# Altium schematic sheet LevelShiftDAC.SchDoc
size A4
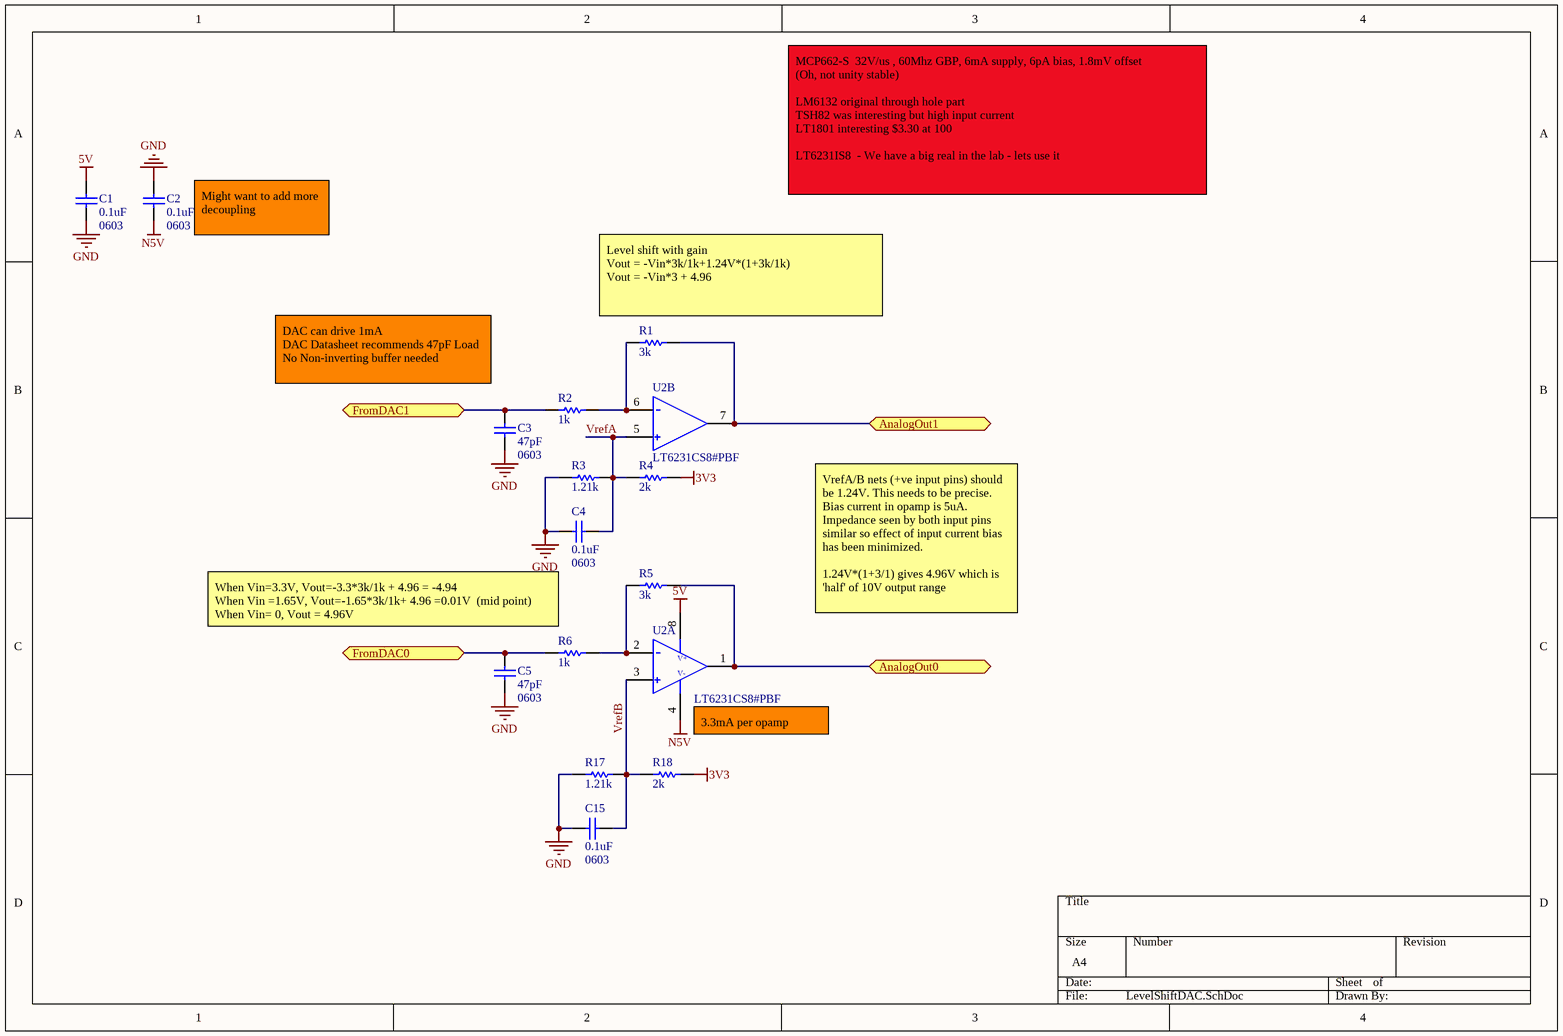
[diagram p0: LevelShiftDAC.SchDoc]

## Parts
C1  0.1uF  [0603]
C2  0.1uF  [0603]
C3  47pF  [0603]
C4  0.1uF  [0603]
C5  47pF  [0603]
C15  0.1uF  [0603]
R1  value 3k  [0603]  (hidden comment: Res0603)
R2  value 1k  [0603]  (hidden comment: Res0603)
R3  value 1.21k  [0603]  (hidden comment: Res0603)
R4  value 2k  [0603]  (hidden comment: Res0603)
R5  value 3k  [0603]  (hidden comment: Res0603)
R6  value 1k  [0603]  (hidden comment: Res0603)
R17  value 1.21k  [0603]  (hidden comment: Res0603)
R18  value 2k  [0603]  (hidden comment: Res0603)
U2  LT6231CS8#PBF  [SO8]  (parts A,B of 2)

## Ports
AnalogOut0, AnalogOut1, FromDAC0, FromDAC1

## Nets
3V3: R4.2 R18.2
5V: C1.2 U2.8(V+)
GND: C1.1 C2.2 C3.1 C4.1 C5.1 C15.1 R3.1 R17.1
N5V: C2.1 U2.4(V-)
AnalogOut0: R5.2 U2.1(Out) ; port AnalogOut0
AnalogOut1: R1.2 U2.7(Out) ; port AnalogOut1
FromDAC0: C5.2 R6.1 ; port FromDAC0
FromDAC1: C3.2 R2.1 ; port FromDAC1
VrefA: C4.2 R3.2 R4.1 U2.5(IN+)
VrefB: C15.2 R17.2 R18.1 U2.3(IN+)
NetR1_1: R1.1 R2.2 U2.6(IN-)
NetR5_1: R5.1 R6.2 U2.2(IN-)

## Notes on the sheet
- (near C2) Might want to add more decoupling
- MCP662-S  32V/us , 60Mhz GBP, 6mA supply, 6pA bias, 1.8mV offset
  (Oh, not unity stable)
  LM6132 original through hole part
  TSH82 was interesting but high input current
  LT1801 interesting $3.30 at 100
  LT6231IS8  - We have a big real in the lab - lets use it
- (near R1) Level shift with gain
  Vout = -Vin*3k/1k+1.24V*(1+3k/1k)
  Vout = -Vin*3 + 4.96
- (near C3) DAC can drive 1mA
  DAC Datasheet recommends 47pF Load
  No Non-inverting buffer needed
- When Vin=3.3V, Vout=-3.3*3k/1k + 4.96 = -4.94
  When Vin =1.65V, Vout=-1.65*3k/1k+ 4.96 =0.01V  (mid point)
  When Vin= 0, Vout = 4.96V
- VrefA/B nets (+ve input pins) should be 1.24V. This needs to be precise. Bias current in opamp is 5uA. Impedance seen by both input pins similar so effect of input current bias has been minimized.
  1.24V*(1+3/1) gives 4.96V which is 'half' of 10V output range
- (near U2) 3.3mA per opamp

## Library data of the parts
C1 C2 C4 C15 = Cap0603: Capacitor, Ceramic, 0603; Manufacturer: Samsung Electro-Mechanics; Manufacturers Part Number: CL10A104KA8NNNC; Assembly Comments: none; Loaded: True; Value: 0.1uF 25V; TechInf: *; Param1: *; Part constraints: CL10A104KA8NNNC; Supplier 1: Digi-Key; Supplier Part Number 1: 1276-1857-1-ND; SupplierUnitCost: $0.02092
C3 C5 = Cap0603: Capacitor, Ceramic, 0603; Manufacturer: Wurth Electronics Inc.; Manufacturers Part Number: 885012006021; Assembly Comments: none; Loaded: True; Value: 47pF 16V; TechInf: *; Param1: *; Part constraints: 885012006021; Supplier 1: Digi-Key; Supplier Part Number 1: 732-7764-1-ND; SupplierUnitCost: $0.02990
R1 R5 = Res0603: Resistor; Manufacturer: Vishay Dale; Manufacturers Part Number: CRCW06033K00FKEAC; Assembly Comments: none; Loaded: True; TechInfo: *; Part constraints: CRCW06033K00FKEAC; Supplier 1: Digi-Key; Supplier Part Number 1: 541-4040-1-ND; SupplierUnitCost: $0.018
R2 R6 = Res0603: Resistor; Manufacturer: Yageo; Manufacturers Part Number: RC0603FR-071KL; Assembly Comments: none; Loaded: True; TechInfo: *; Part constraints: RC0603FR-071KL; Supplier 1: Digi-Key; Supplier Part Number 1: 311-1.00KHRCT-ND; SupplierUnitCost: $0.016
R3 R17 = Res0603: Resistor; Manufacturer: Yageo; Manufacturers Part Number: RMCF0603FT1K21; Assembly Comments: none; Loaded: True; TechInfo: *; Part constraints: RMCF0603FT1K21; Supplier 1: Digi-Key; Supplier Part Number 1: RMCF0603FT1K21CT-ND; SupplierUnitCost: $0.0107
R4 R18 = Res0603: Resistor; Manufacturer: Vishay Dale; Manufacturers Part Number: CRCW06032K00FKEAC; Assembly Comments: none; Loaded: True; TechInfo: *; Part constraints: CRCW06032K00FKEAC; Supplier 1: Digi-Key; Supplier Part Number 1: 541-3953-1-ND; SupplierUnitCost: $0.01180
U2 = TSH82IYDT: Dual R-R Opamp Soic 8 215Mhz GBP; Manufacturer: Linear Technology/Analog Devices; Assembly Comments: none; Loaded: True; Supplier 1: Digi-Key; Supplier Part Number 1: LT6231CS8#PBF-ND; Part Constraints: LT6231CS8; Manufacturers Part Number: LT6231CS8; SupplierUnitCost: $3.5